# Altium schematic sheet A7_POWER - Ⅱ.SchDoc
size A3
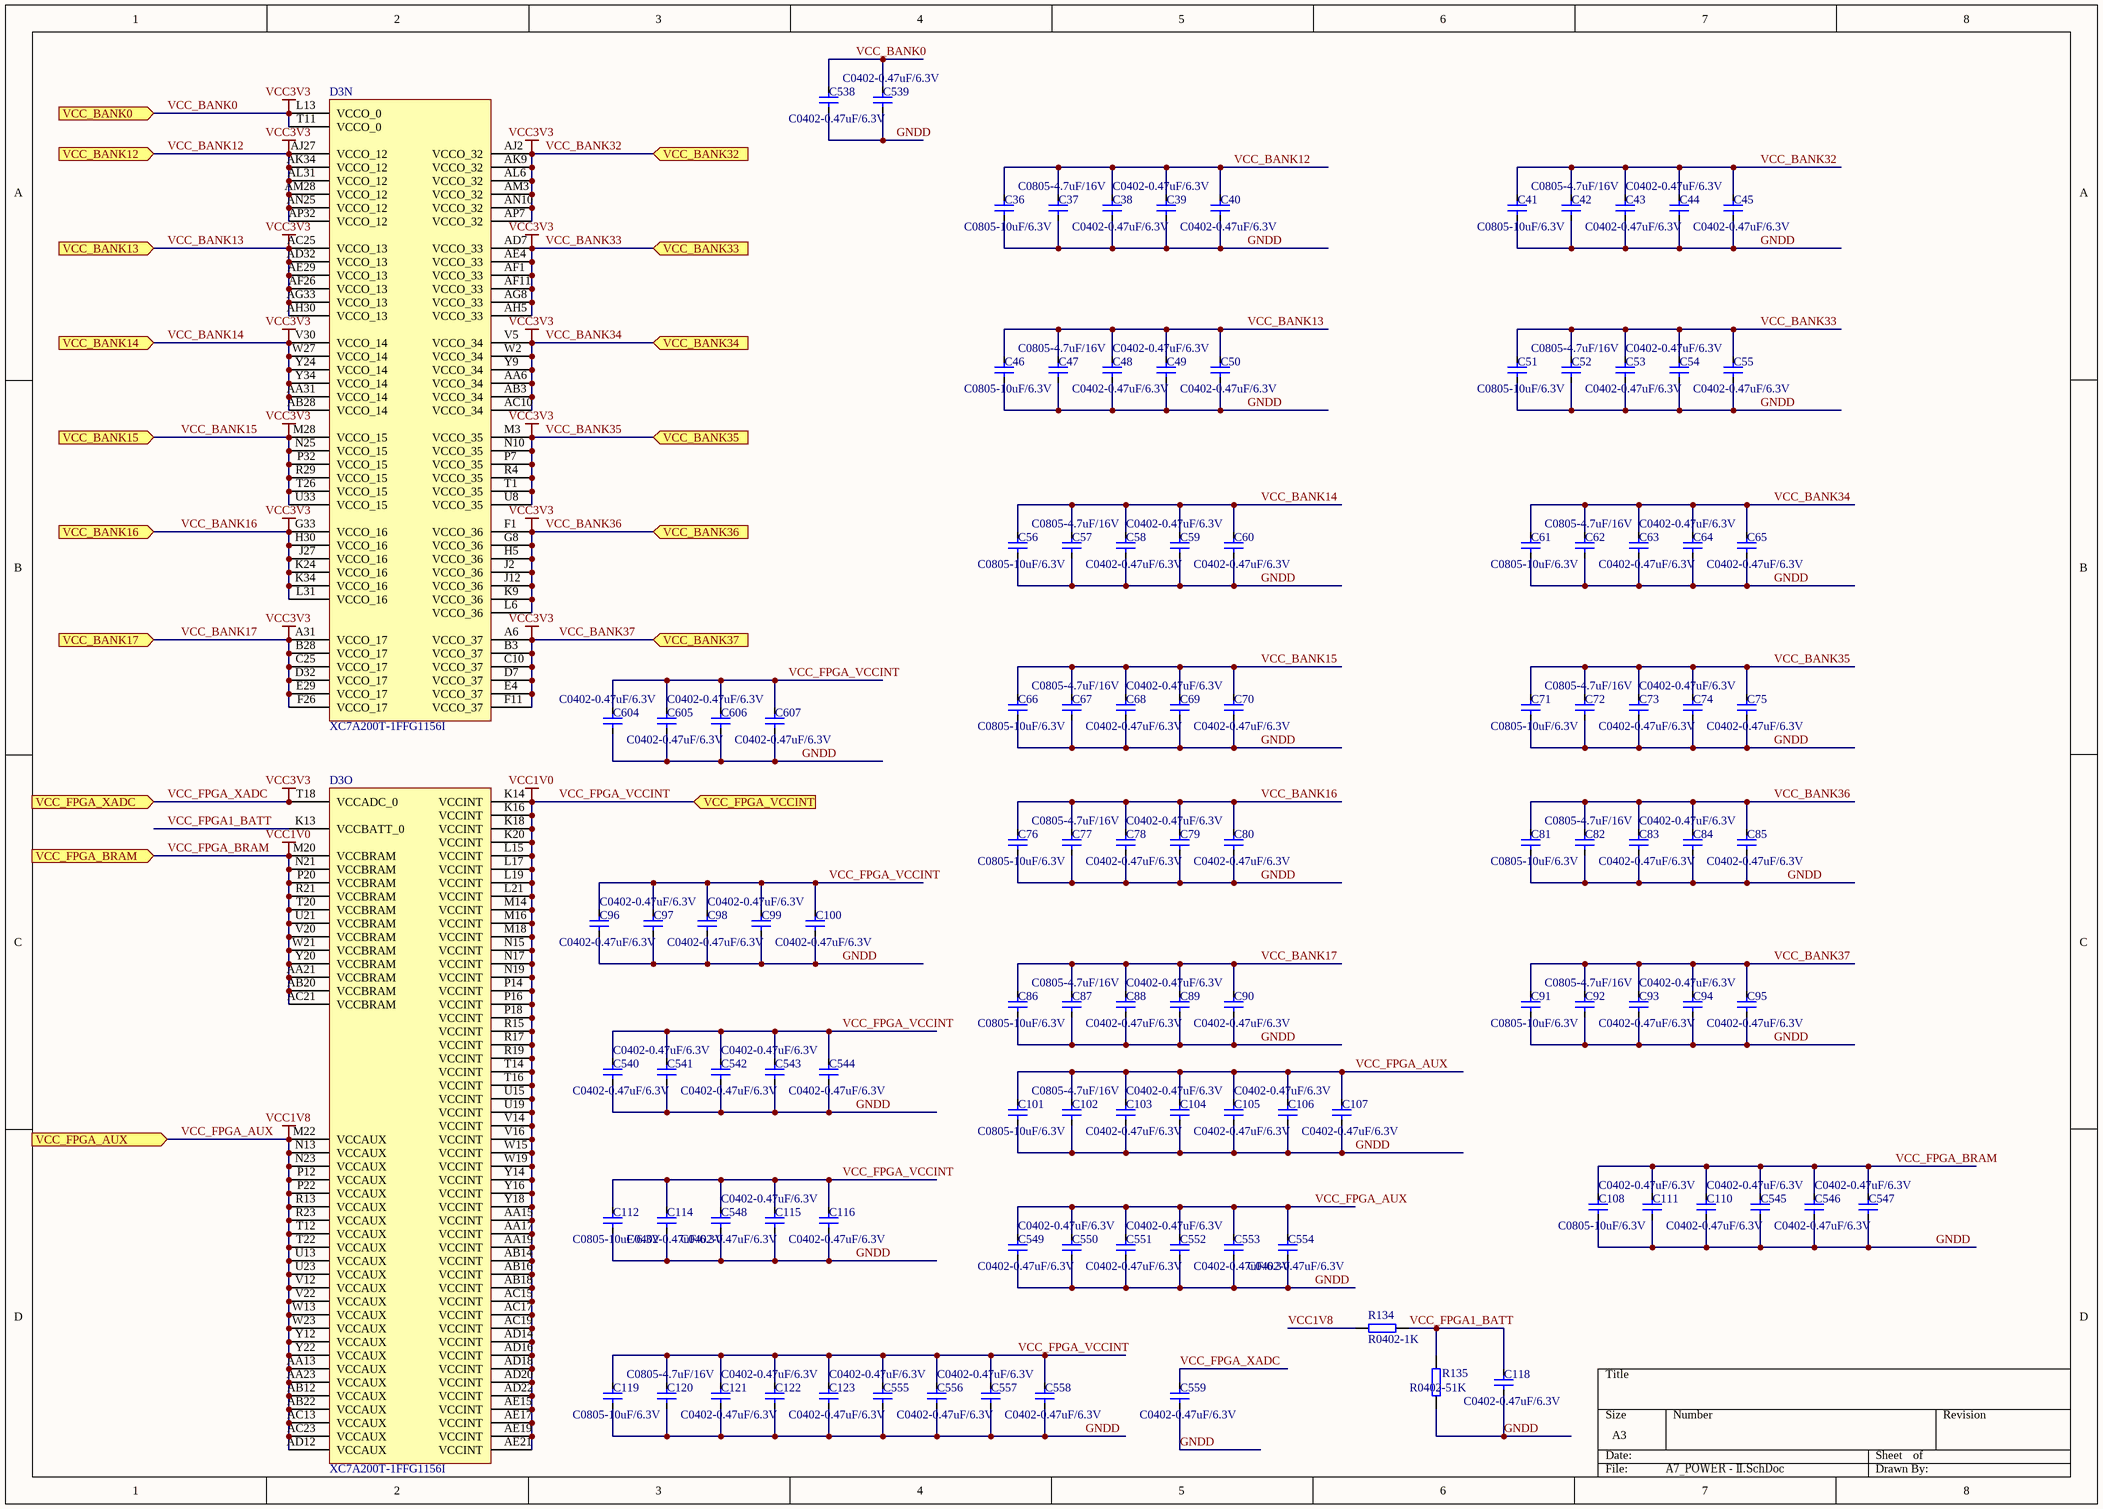
[diagram p0: A7_POWER - Ⅱ.SchDoc]

## Parts
C36  C0805-10uF/6.3V  [C0805]
C37  C0805-4.7uF/16V  [C0805]
C38  C0402-0.47uF/6.3V  [C0402]
C39  C0402-0.47uF/6.3V  [C0402]
C40  C0402-0.47uF/6.3V  [C0402]
C41  C0805-10uF/6.3V  [C0805]
C42  C0805-4.7uF/16V  [C0805]
C43  C0402-0.47uF/6.3V  [C0402]
C44  C0402-0.47uF/6.3V  [C0402]
C45  C0402-0.47uF/6.3V  [C0402]
C46  C0805-10uF/6.3V  [C0805]
C47  C0805-4.7uF/16V  [C0805]
C48  C0402-0.47uF/6.3V  [C0402]
C49  C0402-0.47uF/6.3V  [C0402]
C50  C0402-0.47uF/6.3V  [C0402]
C51  C0805-10uF/6.3V  [C0805]
C52  C0805-4.7uF/16V  [C0805]
C53  C0402-0.47uF/6.3V  [C0402]
C54  C0402-0.47uF/6.3V  [C0402]
C55  C0402-0.47uF/6.3V  [C0402]
C56  C0805-10uF/6.3V  [C0805]
C57  C0805-4.7uF/16V  [C0805]
C58  C0402-0.47uF/6.3V  [C0402]
C59  C0402-0.47uF/6.3V  [C0402]
C60  C0402-0.47uF/6.3V  [C0402]
C61  C0805-10uF/6.3V  [C0805]
C62  C0805-4.7uF/16V  [C0805]
C63  C0402-0.47uF/6.3V  [C0402]
C64  C0402-0.47uF/6.3V  [C0402]
C65  C0402-0.47uF/6.3V  [C0402]
C66  C0805-10uF/6.3V  [C0805]
C67  C0805-4.7uF/16V  [C0805]
C68  C0402-0.47uF/6.3V  [C0402]
C69  C0402-0.47uF/6.3V  [C0402]
C70  C0402-0.47uF/6.3V  [C0402]
C71  C0805-10uF/6.3V  [C0805]
C72  C0805-4.7uF/16V  [C0805]
C73  C0402-0.47uF/6.3V  [C0402]
C74  C0402-0.47uF/6.3V  [C0402]
C75  C0402-0.47uF/6.3V  [C0402]
C76  C0805-10uF/6.3V  [C0805]
C77  C0805-4.7uF/16V  [C0805]
C78  C0402-0.47uF/6.3V  [C0402]
C79  C0402-0.47uF/6.3V  [C0402]
C80  C0402-0.47uF/6.3V  [C0402]
C81  C0805-10uF/6.3V  [C0805]
C82  C0805-4.7uF/16V  [C0805]
C83  C0402-0.47uF/6.3V  [C0402]
C84  C0402-0.47uF/6.3V  [C0402]
C85  C0402-0.47uF/6.3V  [C0402]
C86  C0805-10uF/6.3V  [C0805]
C87  C0805-4.7uF/16V  [C0805]
C88  C0402-0.47uF/6.3V  [C0402]
C89  C0402-0.47uF/6.3V  [C0402]
C90  C0402-0.47uF/6.3V  [C0402]
C91  C0805-10uF/6.3V  [C0805]
C92  C0805-4.7uF/16V  [C0805]
C93  C0402-0.47uF/6.3V  [C0402]
C94  C0402-0.47uF/6.3V  [C0402]
C95  C0402-0.47uF/6.3V  [C0402]
C96  C0402-0.47uF/6.3V  [C0402]
C97  C0402-0.47uF/6.3V  [C0402]
C98  C0402-0.47uF/6.3V  [C0402]
C99  C0402-0.47uF/6.3V  [C0402]
C100  C0402-0.47uF/6.3V  [C0402]
C101  C0805-10uF/6.3V  [C0805]
C102  C0805-4.7uF/16V  [C0805]
C103  C0402-0.47uF/6.3V  [C0402]
C104  C0402-0.47uF/6.3V  [C0402]
C105  C0402-0.47uF/6.3V  [C0402]
C106  C0402-0.47uF/6.3V  [C0402]
C107  C0402-0.47uF/6.3V  [C0402]
C108  C0805-10uF/6.3V  [C0805]
C110  C0402-0.47uF/6.3V  [C0402]
C111  C0402-0.47uF/6.3V  [C0402]
C112  C0805-10uF/6.3V  [C0805]
C114  C0402-0.47uF/6.3V  [C0402]
C115  C0402-0.47uF/6.3V  [C0402]
C116  C0402-0.47uF/6.3V  [C0402]
C118  C0402-0.47uF/6.3V  [C0402]
C119  C0805-10uF/6.3V  [C0805]
C120  C0805-4.7uF/16V  [C0805]
C121  C0402-0.47uF/6.3V  [C0402]
C122  C0402-0.47uF/6.3V  [C0402]
C123  C0402-0.47uF/6.3V  [C0402]
C538  C0402-0.47uF/6.3V  [C0402]
C539  C0402-0.47uF/6.3V  [C0402]
C540  C0402-0.47uF/6.3V  [C0402]
C541  C0402-0.47uF/6.3V  [C0402]
C542  C0402-0.47uF/6.3V  [C0402]
C543  C0402-0.47uF/6.3V  [C0402]
C544  C0402-0.47uF/6.3V  [C0402]
C545  C0402-0.47uF/6.3V  [C0402]
C546  C0402-0.47uF/6.3V  [C0402]
C547  C0402-0.47uF/6.3V  [C0402]
C548  C0402-0.47uF/6.3V  [C0402]
C549  C0402-0.47uF/6.3V  [C0402]
C550  C0402-0.47uF/6.3V  [C0402]
C551  C0402-0.47uF/6.3V  [C0402]
C552  C0402-0.47uF/6.3V  [C0402]
C553  C0402-0.47uF/6.3V  [C0402]
C554  C0402-0.47uF/6.3V  [C0402]
C555  C0402-0.47uF/6.3V  [C0402]
C556  C0402-0.47uF/6.3V  [C0402]
C557  C0402-0.47uF/6.3V  [C0402]
C558  C0402-0.47uF/6.3V  [C0402]
C559  C0402-0.47uF/6.3V  [C0402]
C604  C0402-0.47uF/6.3V  [C0402]
C605  C0402-0.47uF/6.3V  [C0402]
C606  C0402-0.47uF/6.3V  [C0402]
C607  C0402-0.47uF/6.3V  [C0402]
D3  XC7A200T-1FFG1156I  [FFG1156]  (parts N,O of 18)
R134  R0402-1K  [R0402]
R135  R0402-51K  [R0402]

## Ports
VCC_BANK0 (in), VCC_BANK12 (in), VCC_BANK13 (in), VCC_BANK14 (in), VCC_BANK15 (in), VCC_BANK16 (in), VCC_BANK17 (in), VCC_BANK32 (in), VCC_BANK33 (in), VCC_BANK34 (in), VCC_BANK35 (in), VCC_BANK36 (in), VCC_BANK37 (in), VCC_FPGA_AUX (in), VCC_FPGA_BRAM (in), VCC_FPGA_VCCINT (in), VCC_FPGA_XADC (in)

## Nets
VCC1V8: C101.1 C102.1 C103.1 C104.1 C105.1 C106.1 C107.1 C549.1 C550.1 C551.1 C552.1 C553.1 C554.1 D3.AA13(VCCAUX) D3.AA23(VCCAUX) D3.AB12(VCCAUX) D3.AB22(VCCAUX) D3.AC13(VCCAUX) D3.AC23(VCCAUX) D3.AD12(VCCAUX) D3.M22(VCCAUX) D3.N13(VCCAUX) D3.N23(VCCAUX) D3.P12(VCCAUX) D3.P22(VCCAUX) D3.R13(VCCAUX) D3.R23(VCCAUX) D3.T12(VCCAUX) D3.T22(VCCAUX) D3.U13(VCCAUX) D3.U23(VCCAUX) D3.V12(VCCAUX) D3.V22(VCCAUX) D3.W13(VCCAUX) D3.W23(VCCAUX) D3.Y12(VCCAUX) D3.Y22(VCCAUX) R134.2 ; port VCC_FPGA_AUX  [also labelled VCC_FPGA_AUX]
VCC_BANK0: C36.1 C37.1 C38.1 C39.1 C40.1 C41.1 C42.1 C43.1 C44.1 C45.1 C46.1 C47.1 C48.1 C49.1 C50.1 C51.1 C52.1 C53.1 C54.1 C55.1 C56.1 C57.1 C58.1 C59.1 C60.1 C61.1 C62.1 C63.1 C64.1 C65.1 C66.1 C67.1 C68.1 C69.1 C70.1 C71.1 C72.1 C73.1 C74.1 C75.1 C76.1 C77.1 C78.1 C79.1 C80.1 C81.1 C82.1 C83.1 C84.1 C85.1 C86.1 C87.1 C88.1 C89.1 C90.1 C91.1 C92.1 C93.1 C94.1 C95.1 C538.1 C539.1 C559.1 D3.A6(VCCO_37) D3.A31(VCCO_17) D3.AA6(VCCO_34) D3.AA31(VCCO_14) D3.AB3(VCCO_34) D3.AB28(VCCO_14) D3.AC10(VCCO_34) D3.AC25(VCCO_13) D3.AD7(VCCO_33) D3.AD32(VCCO_13) D3.AE4(VCCO_33) D3.AE29(VCCO_13) D3.AF1(VCCO_33) D3.AF11(VCCO_33) D3.AF26(VCCO_13) D3.AG8(VCCO_33) D3.AG33(VCCO_13) D3.AH5(VCCO_33) D3.AH30(VCCO_13) D3.AJ2(VCCO_32) D3.AJ27(VCCO_12) D3.AK9(VCCO_32) D3.AK34(VCCO_12) D3.AL6(VCCO_32) D3.AL31(VCCO_12) D3.AM3(VCCO_32) D3.AM28(VCCO_12) D3.AN10(VCCO_32) D3.AN25(VCCO_12) D3.AP7(VCCO_32) D3.AP32(VCCO_12) D3.B3(VCCO_37) D3.B28(VCCO_17) D3.C10(VCCO_37) D3.C25(VCCO_17) D3.D7(VCCO_37) D3.D32(VCCO_17) D3.E4(VCCO_37) D3.E29(VCCO_17) D3.F1(VCCO_36) D3.F11(VCCO_37) D3.F26(VCCO_17) D3.G8(VCCO_36) D3.G33(VCCO_16) D3.H5(VCCO_36) D3.H30(VCCO_16) D3.J2(VCCO_36) D3.J12(VCCO_36) D3.J27(VCCO_16) D3.K9(VCCO_36) D3.K24(VCCO_16) D3.K34(VCCO_16) D3.L6(VCCO_36) D3.L13(VCCO_0) D3.L31(VCCO_16) D3.M3(VCCO_35) D3.M28(VCCO_15) D3.N10(VCCO_35) D3.N25(VCCO_15) D3.P7(VCCO_35) D3.P32(VCCO_15) D3.R4(VCCO_35) D3.R29(VCCO_15) D3.T1(VCCO_35) D3.T11(VCCO_0) D3.T18(VCCADC_0) D3.T26(VCCO_15) D3.U8(VCCO_35) D3.U33(VCCO_15) D3.V5(VCCO_34) D3.V30(VCCO_14) D3.W2(VCCO_34) D3.W27(VCCO_14) D3.Y9(VCCO_34) D3.Y24(VCCO_14) D3.Y34(VCCO_14) ; port VCC_BANK0, port VCC_BANK12, port VCC_BANK13, port VCC_BANK14, port VCC_BANK15, port VCC_BANK16, port VCC_BANK17, port VCC_FPGA_XADC, port VCC_BANK32, port VCC_BANK33, port VCC_BANK34, port VCC_BANK35, port VCC_BANK36, port VCC_BANK37  [also labelled VCC3V3, VCC_BANK12, VCC_BANK13, VCC_BANK14, VCC_BANK15, VCC_BANK16, VCC_BANK17, VCC_BANK32, VCC_BANK33, VCC_BANK34, VCC_BANK35, VCC_BANK36, VCC_BANK37, VCC_FPGA_XADC]
VCC_FPGA_BRAM: C96.1 C97.1 C98.1 C99.1 C100.1 C108.1 C110.1 C111.1 C112.1 C114.1 C115.1 C116.1 C119.1 C120.1 C121.1 C122.1 C123.1 C540.1 C541.1 C542.1 C543.1 C544.1 C545.1 C546.1 C547.1 C548.1 C555.1 C556.1 C557.1 C558.1 C604.1 C605.1 C606.1 C607.1 D3.AA15(VCCINT) D3.AA17(VCCINT) D3.AA19(VCCINT) D3.AA21(VCCBRAM) D3.AB14(VCCINT) D3.AB16(VCCINT) D3.AB18(VCCINT) D3.AB20(VCCBRAM) D3.AC15(VCCINT) D3.AC17(VCCINT) D3.AC19(VCCINT) D3.AC21(VCCBRAM) D3.AD14(VCCINT) D3.AD16(VCCINT) D3.AD18(VCCINT) D3.AD20(VCCINT) D3.AD22(VCCINT) D3.AE15(VCCINT) D3.AE17(VCCINT) D3.AE19(VCCINT) D3.AE21(VCCINT) D3.K14(VCCINT) D3.K16(VCCINT) D3.K18(VCCINT) D3.K20(VCCINT) D3.L15(VCCINT) D3.L17(VCCINT) D3.L19(VCCINT) D3.L21(VCCINT) D3.M14(VCCINT) D3.M16(VCCINT) D3.M18(VCCINT) D3.M20(VCCBRAM) D3.N15(VCCINT) D3.N17(VCCINT) D3.N19(VCCINT) D3.N21(VCCBRAM) D3.P14(VCCINT) D3.P16(VCCINT) D3.P18(VCCINT) D3.P20(VCCBRAM) D3.R15(VCCINT) D3.R17(VCCINT) D3.R19(VCCINT) D3.R21(VCCBRAM) D3.T14(VCCINT) D3.T16(VCCINT) D3.T20(VCCBRAM) D3.U15(VCCINT) D3.U19(VCCINT) D3.U21(VCCBRAM) D3.V14(VCCINT) D3.V16(VCCINT) D3.V20(VCCBRAM) D3.W15(VCCINT) D3.W19(VCCINT) D3.W21(VCCBRAM) D3.Y14(VCCINT) D3.Y16(VCCINT) D3.Y18(VCCINT) D3.Y20(VCCBRAM) ; port VCC_FPGA_BRAM, port VCC_FPGA_VCCINT  [also labelled VCC1V0, VCC_FPGA_VCCINT]
GNDD: C36.2 C37.2 C38.2 C39.2 C40.2 C41.2 C42.2 C43.2 C44.2 C45.2 C46.2 C47.2 C48.2 C49.2 C50.2 C51.2 C52.2 C53.2 C54.2 C55.2 C56.2 C57.2 C58.2 C59.2 C60.2 C61.2 C62.2 C63.2 C64.2 C65.2 C66.2 C67.2 C68.2 C69.2 C70.2 C71.2 C72.2 C73.2 C74.2 C75.2 C76.2 C77.2 C78.2 C79.2 C80.2 C81.2 C82.2 C83.2 C84.2 C85.2 C86.2 C87.2 C88.2 C89.2 C90.2 C91.2 C92.2 C93.2 C94.2 C95.2 C96.2 C97.2 C98.2 C99.2 C100.2 C101.2 C102.2 C103.2 C104.2 C105.2 C106.2 C107.2 C108.2 C110.2 C111.2 C112.2 C114.2 C115.2 C116.2 C118.2 C119.2 C120.2 C121.2 C122.2 C123.2 C538.2 C539.2 C540.2 C541.2 C542.2 C543.2 C544.2 C545.2 C546.2 C547.2 C548.2 C549.2 C550.2 C551.2 C552.2 C553.2 C554.2 C555.2 C556.2 C557.2 C558.2 C559.2 C604.2 C605.2 C606.2 C607.2 R135.1
VCC_FPGA1_BATT: C118.1 D3.K13(VCCBATT_0) R134.1 R135.2

## Library data of the parts
C36 C41 C46 C51 C56 C61 C66 C71 C76 C81 C86 C91 C101 C108 C112 C119 = C1210-22uF/16V: Part_number: C0805-10uF/6.3V; Part_type: CAP; Value: C0805-10uF/6.3V; Schematic_Part: CAP; PCB_Footprint: C0805
C37 C42 C47 C52 C57 C62 C67 C72 C77 C82 C87 C92 C102 C120 = C0805-4.7uF/50V: X7R; Manufacturer: SAMSUNG; Part_number: C0805-4.7uF/16V; Part_type: CAP; Value: C0805-4.7uF/16V; Schematic_Part: CAP; PCB_Footprint: C0805; datasheet: #DataSheet\C_Samsung_General Capacitors.pdf#
C38-C40 C43-C45 C48-C50 C53-C55 C58-C60 C63-C65 C68-C70 C73-C75 C78-C80 C83-C85 C88-C90 C93-C100 C103-C107 C110 C111 C114-C116 C118 C121-C123 C538-C559 C604-C607 = C0402-0.1uF/16V: X7R; Manufacturer: SAMSUNG; Manufacturer_p/n: CL05X7R104KO5NNN; Part_number: C0402-0.47uF/6.3V; Part_type: CAP; Value: C0402-0.47uF/6.3V; temperature: -55℃\+125℃; Schematic_Part: CAP; PCB_Footprint: C0402; datasheet: #DataSheet\C_Samsung_General Capacitors.pdf#
D3 = XC7A200T-1FFG1156I: Artix-7 FPGA, 500 User I/Os, 16 GTP, 1156-Ball BGA, Speed Grade 1, Industrial Grade, Pb-Free; Manufacturer: Xilinx; Block RAM Blocks (18Kb): 730; Block RAM Blocks (36Kb): 365; Block RAM Blocks (Max Kb): 13140; CLBs (Slices): 33650; Clock Mgmt Tiles (CMTs): 10; DSP48E1 Slices: 740; Logic Cells: 215360; Max User I/O: 500; Speed Grade: -1; DatasheetVersion: v1.12; PackageVersion: Rev 1.8; PackageReference: FFG1156; PackageDescription: Flip-Chip BGA, Body 35 x 35 mm, 1.0 mm Pitch; CLBs (Max Distributed RAM Kb): 2888; Generic Part Number: XC7A200T; RoHS: Pb-Free; Mounting Technology: Surface Mount; Code_JEDEC: MS-034-AAR-1; PartNumber: XC7A200T-1FFG1156I; ComponentLink1Description: Datasheet; ComponentLink1URL: http://www.xilinx.com/support/documentation/data_sheets/ds180_7Series_Overview.pdf; ComponentLink2Description: Package Specification; ComponentLink2URL: http://www.xilinx.com/support/documentation/user_guides/ug475_7Series_Pkg_Pinout.pdf; ComponentLink3Description: DC and Switching Characteristics; ComponentLink3URL: http://www.xilinx.com/support/documentation/data_sheets/ds181_Artix_7_Data_Sheet.pdf; ComponentLink4Description: Package File; ComponentLink4URL: http://www.xilinx.com/support/packagefiles/a7packages/xc7a200tfbg676pkg.txt; ComponentLink5Description: Packaging and Pinout; ComponentLink5URL: http://www.xilinx.com/support/documentation/user_guides/ug475_7Series_Pkg_Pinout.pdf
R134 R135 = R0402-10K: Manufacturer: SAMSUNG; Part_type: RES; Schematic_Part: RES; PCB_Footprint: R0402
  R134: Part_number: R0402-1K; Value: R0402-1K
  R135: Part_number: R0402-51K; Value: R0402-51K